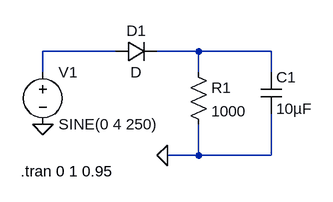
[diagram p0: schematic Draft1.asc]
Draft1.asc, the LTspice schematic file:
Version 4
SHEET 1 880 680
WIRE 128 96 16 96
WIRE 256 96 192 96
WIRE 368 96 256 96
WIRE 16 128 16 96
WIRE 256 128 256 96
WIRE 368 128 368 96
WIRE 256 256 256 208
WIRE 256 256 208 256
WIRE 368 256 368 192
WIRE 368 256 256 256
FLAG 16 208 0
FLAG 208 256 0
SYMBOL voltage 16 112 R0
WINDOW 123 0 0 Left 0
WINDOW 39 0 0 Left 0
SYMATTR InstName V1
SYMATTR Value SINE(0 4 250)
SYMBOL diode 128 112 R270
WINDOW 0 32 32 VTop 2
WINDOW 3 0 32 VBottom 2
SYMATTR InstName D1
SYMBOL res 240 112 R0
SYMATTR InstName R1
SYMATTR Value 1000
SYMBOL cap 352 128 R0
SYMATTR InstName C1
SYMATTR Value 10µF
TEXT -18 280 Left 2 !.tran 0 1 0.95

The netlist it stands for:
* Draft1.asc
V1 N001 0 SINE(0 4 250)
D1 N001 N002 D
R1 N002 0 1000
C1 N002 0 10µF
.model D D
.lib standard.dio
.tran 0 1 0.95
.backanno
.end